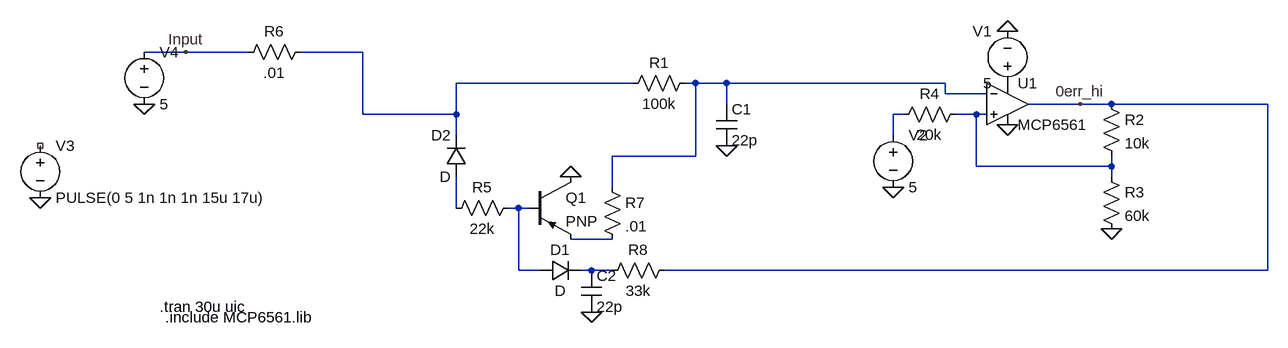
[diagram p0: schematic thingy to fix the 0 error problem.asc]
thingy to fix the 0 error problem.asc, the LTspice schematic file:
Version 4.1
SHEET 1 1256 1028
WIRE -656 64 -720 64
WIRE -560 64 -656 64
WIRE -384 64 -480 64
WIRE 32 112 -240 112
WIRE 128 112 112 112
WIRE 176 112 128 112
WIRE 512 112 176 112
WIRE 512 128 512 112
WIRE 576 128 512 128
WIRE 176 144 176 112
WIRE 720 144 640 144
WIRE 768 144 720 144
WIRE 1008 144 768 144
WIRE -384 160 -384 64
WIRE -240 160 -240 112
WIRE -240 160 -384 160
WIRE 448 160 432 160
WIRE 560 160 528 160
WIRE 576 160 560 160
WIRE -240 192 -240 160
WIRE 432 192 432 160
WIRE 128 224 128 112
WIRE 128 224 0 224
WIRE 560 240 560 160
WIRE 768 240 768 224
WIRE 768 240 560 240
WIRE 768 256 768 240
WIRE 0 272 0 224
WIRE -240 304 -240 256
WIRE -144 304 -160 304
WIRE -128 304 -144 304
WIRE 0 352 -64 352
WIRE -144 400 -144 304
WIRE -112 400 -144 400
WIRE -32 400 -48 400
WIRE 0 400 -32 400
WIRE 1008 400 1008 144
WIRE 1008 400 80 400
FLAG -656 64 Input
FLAG 176 208 0
FLAG 608 176 0
FLAG 608 32 0
FLAG 768 336 0
FLAG 720 144 0err_hi
FLAG 432 272 0
FLAG -880 288 0
FLAG -64 256 0
FLAG -32 464 0
FLAG -720 144 0
SYMBOL res 128 96 R90
WINDOW 0 0 56 VBottom 2
WINDOW 3 32 56 VTop 2
SYMATTR InstName R1
SYMATTR Value 100k
SYMBOL cap 160 144 R0
SYMATTR InstName C1
SYMATTR Value 22p
SYMBOL voltage 608 128 R180
WINDOW 0 24 96 Left 2
WINDOW 3 24 16 Left 2
SYMATTR InstName V1
SYMATTR Value 5
SYMBOL res 752 128 R0
SYMATTR InstName R2
SYMATTR Value 10k
SYMBOL res 752 240 R0
SYMATTR InstName R3
SYMATTR Value 60k
SYMBOL res 544 144 R90
WINDOW 0 0 56 VBottom 2
WINDOW 3 32 56 VTop 2
SYMATTR InstName R4
SYMATTR Value 20k
SYMBOL OpAmps\\opamp2 608 80 R0
SYMATTR InstName U1
SYMATTR Value MCP6561
SYMBOL voltage 432 176 R0
SYMATTR InstName V2
SYMATTR Value 5
SYMBOL voltage -880 192 R0
WINDOW 123 0 0 Left 0
WINDOW 39 0 0 Left 0
SYMATTR InstName V3
SYMATTR Value PULSE(0 5 1n 1n 1n 15u 17u)
SYMBOL pnp -128 256 R0
SYMATTR InstName Q1
SYMBOL res -144 288 R90
WINDOW 0 0 56 VBottom 2
WINDOW 3 32 56 VTop 2
SYMATTR InstName R5
SYMATTR Value 22k
SYMBOL res -464 48 R90
WINDOW 0 0 56 VBottom 2
WINDOW 3 32 56 VTop 2
SYMATTR InstName R6
SYMATTR Value .01
SYMBOL res -16 256 R0
SYMATTR InstName R7
SYMATTR Value .01
SYMBOL res 96 384 R90
WINDOW 0 0 56 VBottom 2
WINDOW 3 32 56 VTop 2
SYMATTR InstName R8
SYMATTR Value 33k
SYMBOL cap -48 400 R0
SYMATTR InstName C2
SYMATTR Value 22p
SYMBOL diode -112 416 R270
WINDOW 0 32 32 VTop 2
WINDOW 3 0 32 VBottom 2
SYMATTR InstName D1
SYMBOL diode -224 256 R180
WINDOW 0 24 64 Left 2
WINDOW 3 24 0 Left 2
SYMATTR InstName D2
SYMBOL voltage -720 48 R0
SYMATTR InstName V4
SYMATTR Value 5
TEXT -688 472 Left 2 !.include MCP6561.lib
TEXT -696 456 Left 2 !.tran 30u uic

The netlist it stands for:
* thingy to fix the 0 error problem.asc
R1 N002 N001 100k
C1 N002 0 22p
V1 P001 0 5
R2 0err_hi N004 10k
R3 N004 0 60k
R4 N004 N003 20k
X§U1 N004 N002 P001 0 0err_hi MCP6561  ; pins In+ In- V+ V- OUT
V2 N003 0 5
V3 NC_01 0 PULSE(0 5 1n 1n 1n 15u 17u)
Q1 0 N006 N007 0 PNP
R5 N006 N005 22k
R6 N001 Input .01
R7 N002 N007 .01
R8 0err_hi N008 33k
C2 N008 0 22p
D1 N006 N008 D
D2 N005 N001 D
V4 Input 0 5
.model D D
.lib standard.dio
.model NPN NPN
.model PNP PNP
.lib standard.bjt
.include MCP6561.lib
.tran 30u uic
.backanno
.end